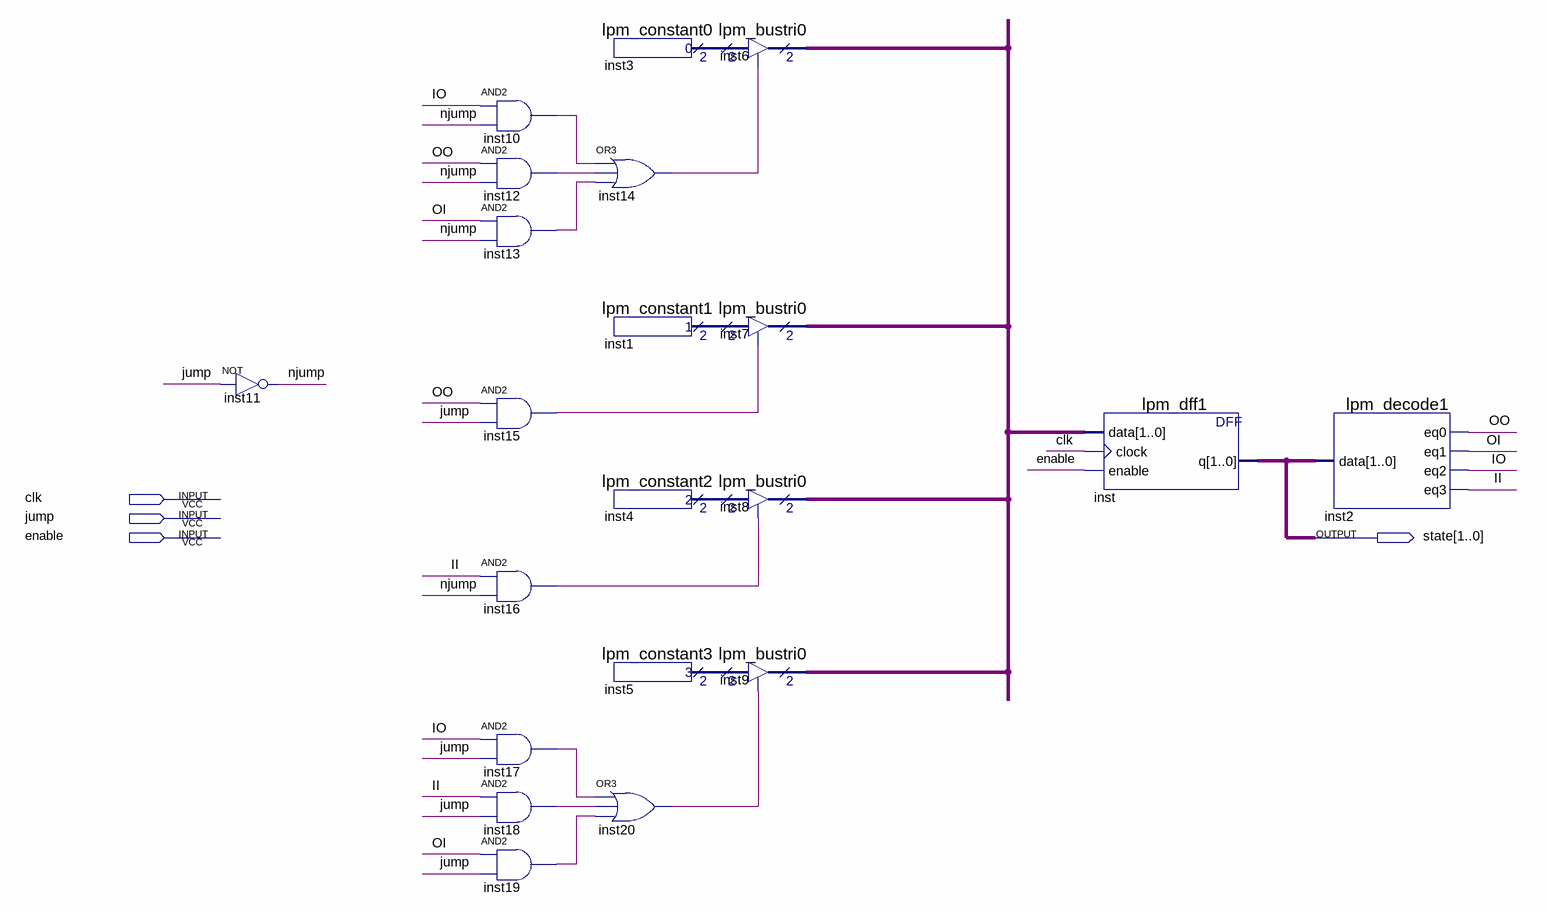
[diagram p0: schematic sheet]
// Quartus schematic Register.bdf as structural Verilog: 21 symbols, 4 pins
module Register (
  input  clk,
  input  jump,
  input  enable,
  output [1:0] state
);

  wire II, inst10_out, inst12_out, inst13_out, inst14_out, inst15_out, inst16_out, inst17_out, inst18_out,
       inst19_out, inst20_out, IO, njump, OI, OO;
  wire [1:0] inst1_result, inst3_result, inst4_result, inst5_result, inst6_tridata;

  not inst11 (njump, jump);
  and inst10 (inst10_out, IO, njump);
  and inst12 (inst12_out, OO, njump);
  and inst13 (inst13_out, OI, njump);
  and inst15 (inst15_out, OO, jump);
  and inst16 (inst16_out, II, njump);
  and inst17 (inst17_out, IO, jump);
  and inst18 (inst18_out, II, jump);
  and inst19 (inst19_out, OI, jump);
  lpm_constant0 inst3 (.result(inst3_result));
  or inst14 (inst14_out, inst10_out, inst12_out, inst13_out);
  lpm_constant1 inst1 (.result(inst1_result));
  lpm_constant2 inst4 (.result(inst4_result));
  lpm_constant3 inst5 (.result(inst5_result));
  or inst20 (inst20_out, inst17_out, inst18_out, inst19_out);
  lpm_bustri0 inst6 (.enabledt(inst14_out), .data(inst3_result), .tridata(inst6_tridata));
  lpm_bustri0 inst7 (.enabledt(inst15_out), .data(inst1_result), .tridata(inst6_tridata));
  lpm_bustri0 inst8 (.enabledt(inst16_out), .data(inst4_result), .tridata(inst6_tridata));
  lpm_bustri0 inst9 (.enabledt(inst20_out), .data(inst5_result), .tridata(inst6_tridata));
  lpm_dff1 inst (.data(inst6_tridata), .clock(clk), .enable(enable), .q(state));
  lpm_decode1 inst2 (.data(state), .eq0(OO), .eq1(OI), .eq2(IO), .eq3(II));
endmodule
